# EAGLE schematic ASSY-SM1000-D (EAGLE 6.5.0)
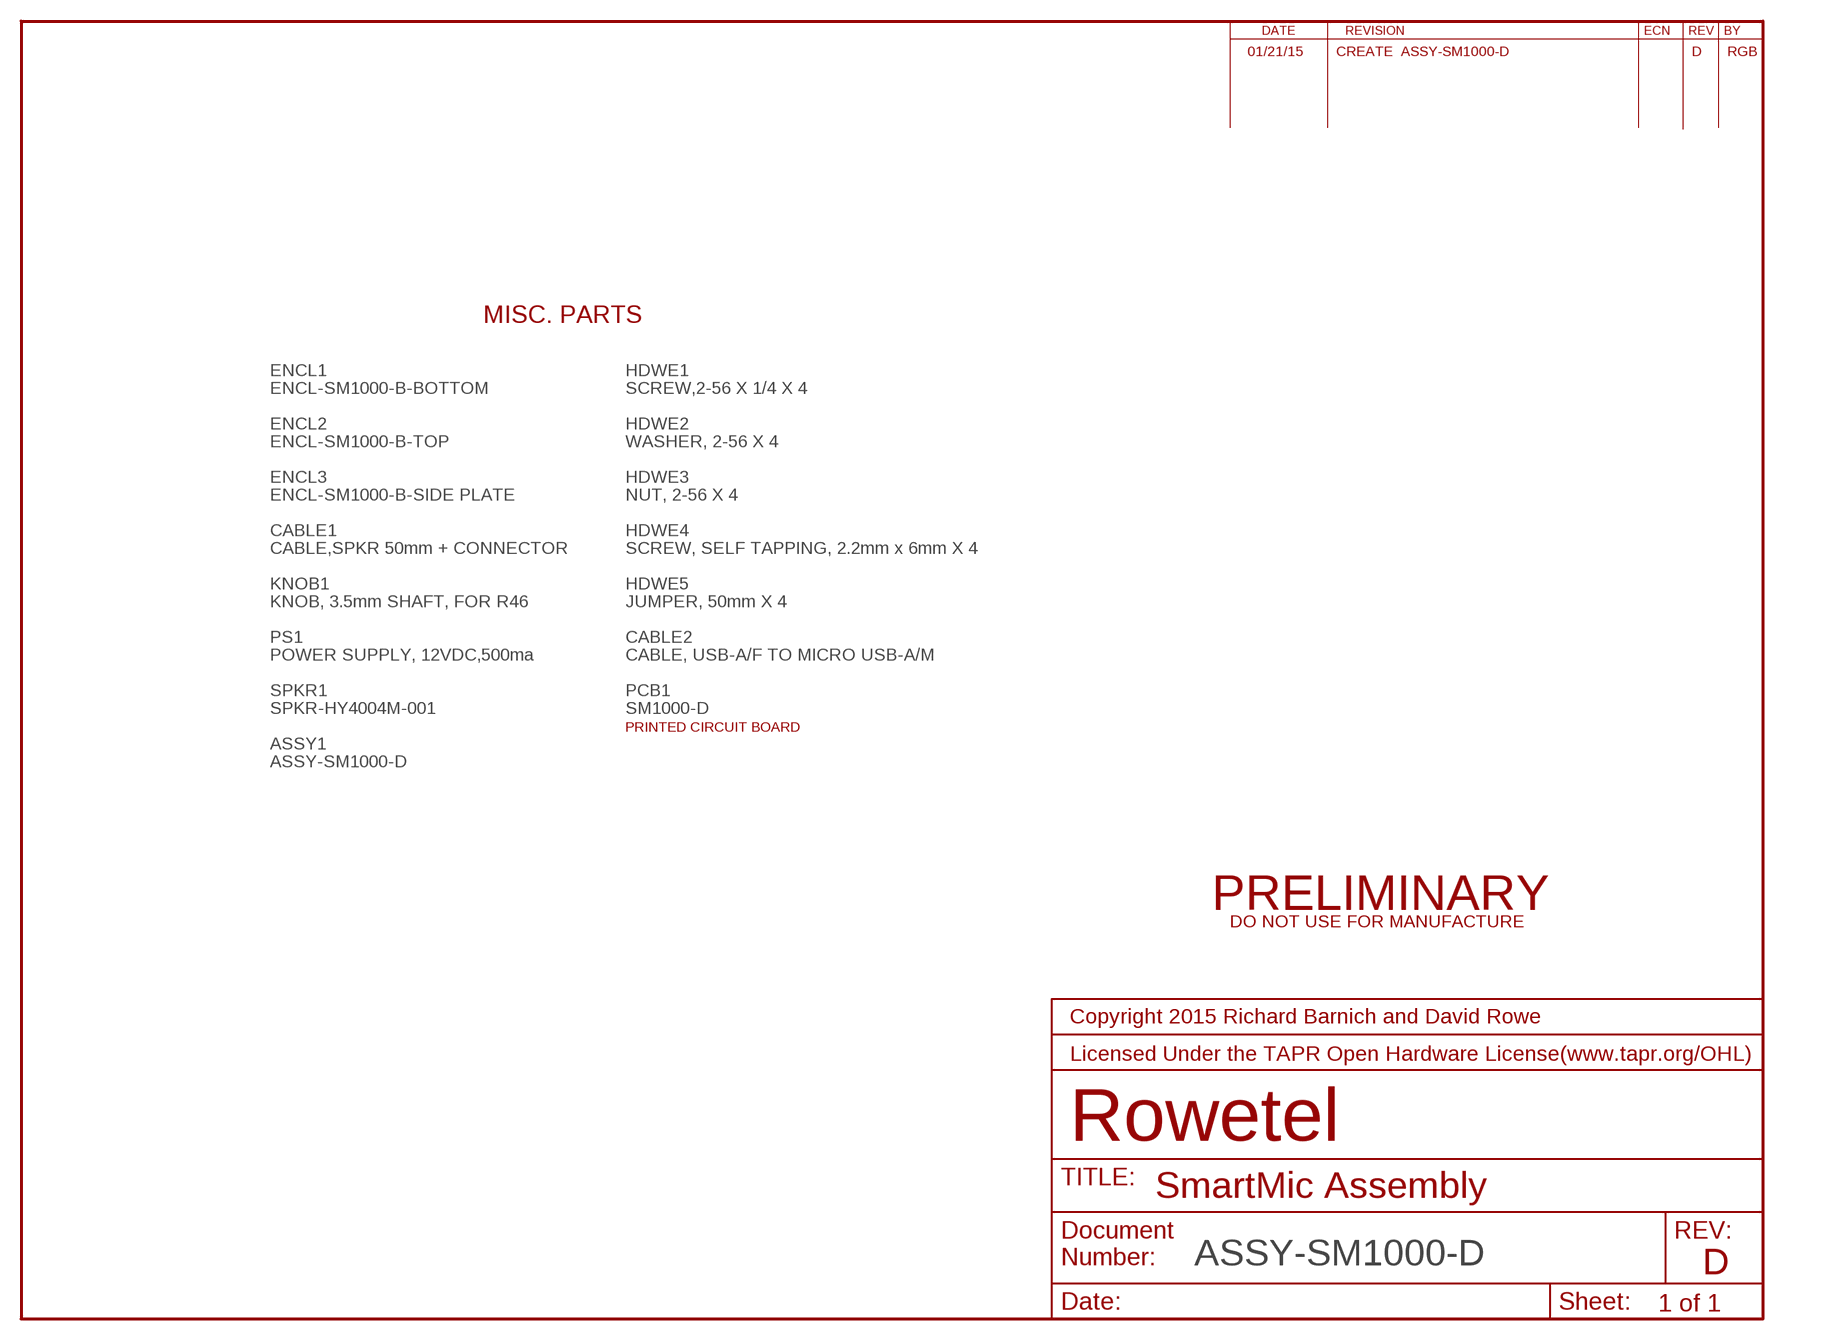
[diagram p0: schematic, sheet 1]

## Parts
ASSY1  ASSY-SM1000-D  ASSY  [NOPACKAGE]
CABLE1  CABLE,SPKR 50mm + CONNECTOR  CABLE  [NOPACKAGE]
CABLE2  CABLE, USB-A/F TO MICRO USB-A/M  CABLE  [NOPACKAGE]
ENCL1  ENCL-SM1000-B-BOTTOM  ENCL  [NOPACKAGE]
ENCL2  ENCL-SM1000-B-TOP  ENCL  [NOPACKAGE]
ENCL3  ENCL-SM1000-B-SIDE PLATE  ENCL  [NOPACKAGE]
HDWE1  SCREW,2-56 X 1/4 X 4  HDWE  [NOPACKAGE]
HDWE2  WASHER, 2-56 X 4  HDWE  [NOPACKAGE]
HDWE3  NUT, 2-56 X 4  HDWE  [NOPACKAGE]
HDWE4  SCREW, SELF TAPPING, 2.2mm x 6mm X 4  HDWE  [NOPACKAGE]
HDWE5  JUMPER, 50mm X 4  HDWE  [NOPACKAGE]
KNOB1  KNOB, 3.5mm SHAFT, FOR R46  KNOB  [NOPACKAGE]
PCB1  SM1000-D  PCB  [NOPACKAGE]
PRELIMINARY1  PRELIMINARY  [NOPACKAGE]
PS1  POWER SUPPLY, 12VDC,500ma  PS  [NOPACKAGE]
SPKR1  SPKR-HY4004M-001  [NOPACKAGE]

## Notes on the sheet
- 01/21/15 | CREATE  ASSY-SM1000-D | D | RGB
- MISC. PARTS
- SmartMic Assembly
- D
- 1 of 1

## Library data of the parts
ASSY1 = _RoweTel:ASSY
CABLE1 CABLE2 = _RoweTel:CABLE
ENCL1-ENCL3 = _RoweTel:ENCL
HDWE1-HDWE5 = _RoweTel:HDWE
KNOB1 = _RoweTel:KNOB
PCB1 = _Coherix:PCB
PRELIMINARY1 = _RoweTel:PRELIMINARY
PS1 = _RoweTel:PS
SPKR1 = _RoweTel:SPKR-HY4004M-001

## Net classes
0 default: width 0.2 mm, drill 0.4 mm, clearance 0.2 mm